# EAGLE design CCM_0021 (EAGLE 9.3.1)
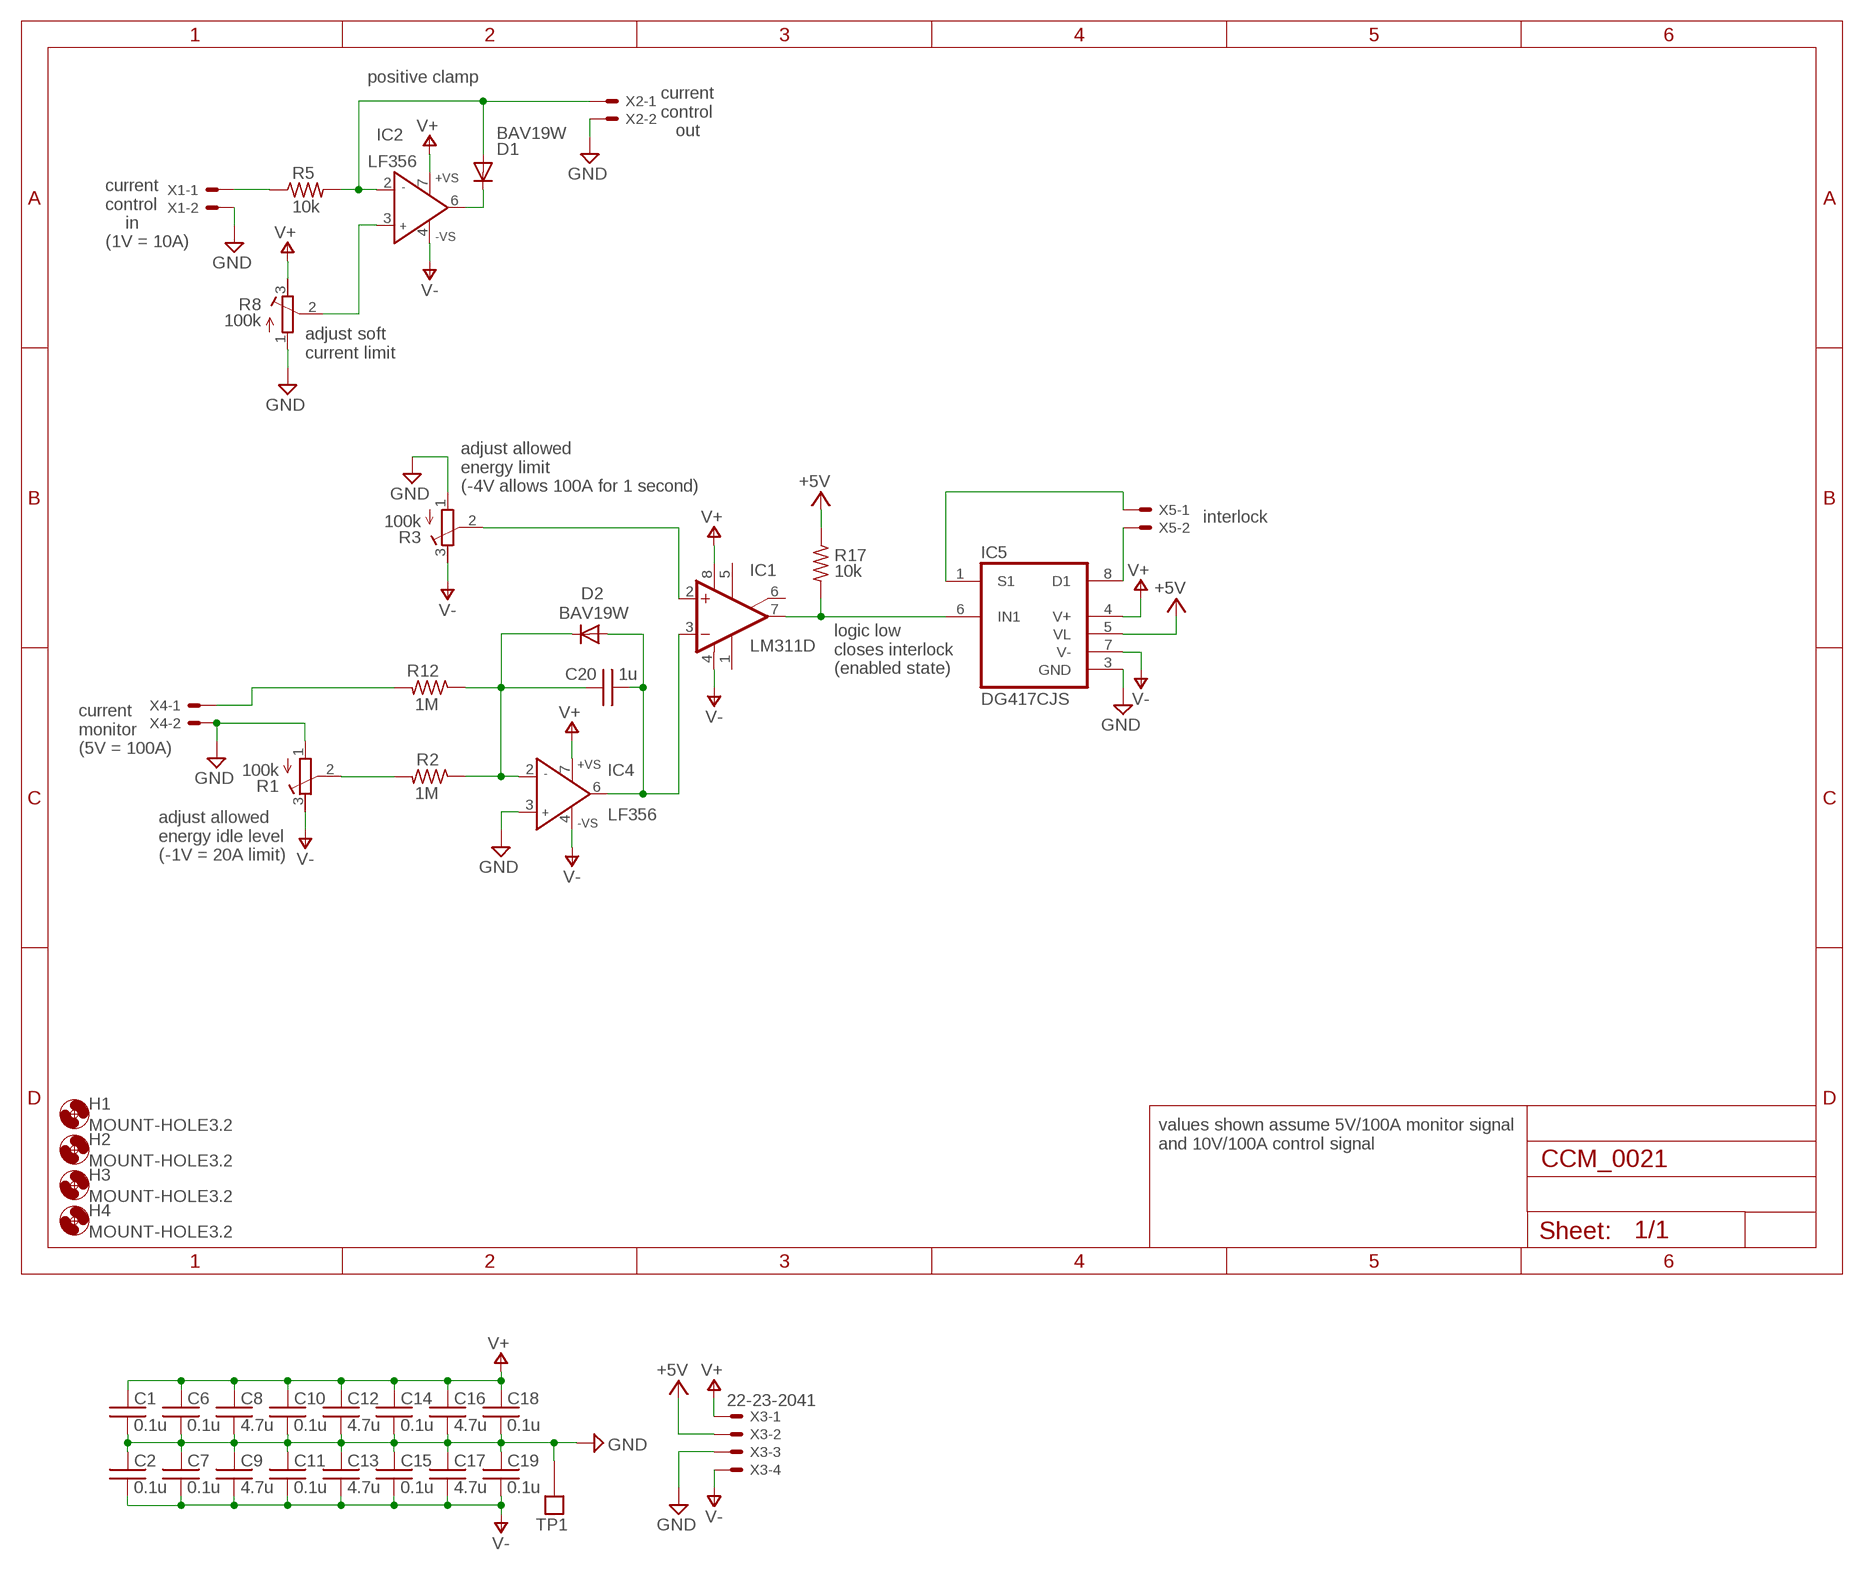
[diagram p0: schematic, sheet 1]

## Parts
C1  0.1u  C0603  [0603]
C2  0.1u  C0603  [0603]
C6  0.1u  C0603  [0603]
C7  0.1u  C0603  [0603]
C8  4.7u  C0603  [0603]
C9  4.7u  C0603  [0603]
C10  0.1u  C0603  [0603]
C11  0.1u  C0603  [0603]
C12  4.7u  C0603  [0603]
C13  4.7u  C0603  [0603]
C14  0.1u  C0603  [0603]
C15  0.1u  C0603  [0603]
C16  4.7u  C0603  [0603]
C17  4.7u  C0603  [0603]
C18  0.1u  C0603  [0603]
C19  0.1u  C0603  [0603]
C20  1u  C0603  [0603]
D1  BAV19W  DIODE-SOD123  [SOD123]
D2  BAV19W  DIODE-SOD123  [SOD123]
H1  MOUNT-HOLE3.2  [3,2]
H2  MOUNT-HOLE3.2  [3,2]
H3  MOUNT-HOLE3.2  [3,2]
H4  MOUNT-HOLE3.2  [3,2]
IC1  LM311D  [SO08]
IC2  LF356  AD825_BR  [SO8]
IC4  LF356  AD825_BR  [SO8]
IC5  DG417CJS  [SO8]
R1  100k  R-TRIMM3296W  [RTRIM3296W]
R2  1M  R0603  [0603]
R3  100k  R-TRIMM3296W  [RTRIM3296W]
R5  10k  R0603  [0603]
R8  100k  R-TRIMM3296W  [RTRIM3296W]
R12  1M  R0603  [0603]
R17  10k  R0603  [0603]
TP1  TESTPOINT  [TESTPOINT]
X1  22-23-2021  [22-23-2021]
X2  22-23-2021  [22-23-2021]
X3  22-23-2041  [22-23-2041]
X4  22-23-2021  [22-23-2021]
X5  22-23-2021  [22-23-2021]

## Nets
+5V: IC5.5(VL) R17.1 X3.2
GND: C1.2 C2.1 C6.2 C7.1 C8.2 C9.1 C10.2 C11.1 C12.2 C13.1 C14.2 C15.1 C16.2 C17.1 C18.2 C19.1 IC4.3(IN+) IC5.3(GND) R1.1(A) R3.1(A) R8.1(A) TP1.P$1 X1.2 X2.2 X3.3 X4.2
N$1: R12.2 X4.1
N$2: R1.2(S) R2.2
N$3: C20.1 D2.A IC1.3(-IN) IC4.6(OUT)
N$4: IC1.2(+IN) R3.2(S)
N$5: IC1.7(OUT) IC5.6(IN1) R17.2
N$7: IC5.1(S1) X5.1
N$8: IC5.8(D1) X5.2
N$9: D1.C IC2.6(OUT)
N$10: IC2.3(IN+) R8.2(S)
N$13: R5.1 X1.1
N$16: D1.A IC2.2(IN-) R5.2 X2.1
N$33: C20.2 D2.C IC4.2(IN-) R2.1 R12.1
V+: C1.1 C6.1 C8.1 C10.1 C12.1 C14.1 C16.1 C18.1 IC1.8(V+) IC2.7(+VS) IC4.7(+VS) IC5.4(V+) R8.3(E) X3.1
V-: C2.2 C7.2 C9.2 C11.2 C13.2 C15.2 C17.2 C19.2 IC1.4(V-) IC2.4(-VS) IC4.4(-VS) IC5.7(V-) R1.3(E) R3.3(E) X3.4
Unconnected: IC1.1(GND) IC1.5(ON) IC1.6(ON/STR)

## Notes on the sheet
- positive clamp
- current
  control
     out
- current
  control
      in
  (1V = 10A)
- adjust soft 
  current limit
- adjust allowed 
  energy limit
  (-4V allows 100A for 1 second)
- interlock
- logic low
  closes interlock
  (enabled state)
- current
  monitor
  (5V = 100A)
- adjust allowed 
  energy idle level
  (-1V = 20A limit)
- values shown assume 5V/100A monitor signal
  and 10V/100A control signal

## Library data of the parts
C1 C2 C6-C20 = acrooptics:C: Capacitor
D1 D2 = AquariumLibrary:DIODE-: DIODE
H1-H4 = holes:MOUNT-HOLE: MOUNTING HOLE with drill center marker
IC1 = linear:LM311: COMPARATOR
IC2 IC4 = noah:AD825_B: Low Cost, General-Purpose High Speed JFET Amplifier Source: http://www.analog.com/static/imported-files/data_sheets/AD825.pdf; MF: ALTERA CORPORATION; MPN: AD825ARZ; OC_FARNELL: 9603735; OC_NEWARK: 59K6528
IC5 = noah:DG417CJ: ANALOG SWITCH
R1 R3 R8 = rcl:R-TRIMM: Trimm resistor; SPICEMODEL: X; SPICEPREFIXL: POT
R2 R5 R12 R17 = acrooptics:R: 0603 resistor
TP1 = Fitch:TESTPOINT
X1 X4 = con-molex:22-23-2021: .100" (2.54mm) Center Header - 2 Pin; MF: MOLEX; MPN: 22-23-2021; OC_FARNELL: 1462926; OC_NEWARK: 25C3832; SPICEPREFIX: X
X2 X5 = con-molex:22-23-2021: .100" (2.54mm) Center Header - 2 Pin; MF: MOLEX; MPN: 22-23-2021; OC_FARNELL: 1462926; OC_NEWARK: 25C3832
X3 = con-molex:22-23-2041: .100" (2.54mm) Center Header - 4 Pin; MF: MOLEX; MPN: 22-23-2041; OC_FARNELL: 1462920; OC_NEWARK: 38C0355

## Net classes
1 standard: width 0.61 mm, clearance 0.254 mm

## Board
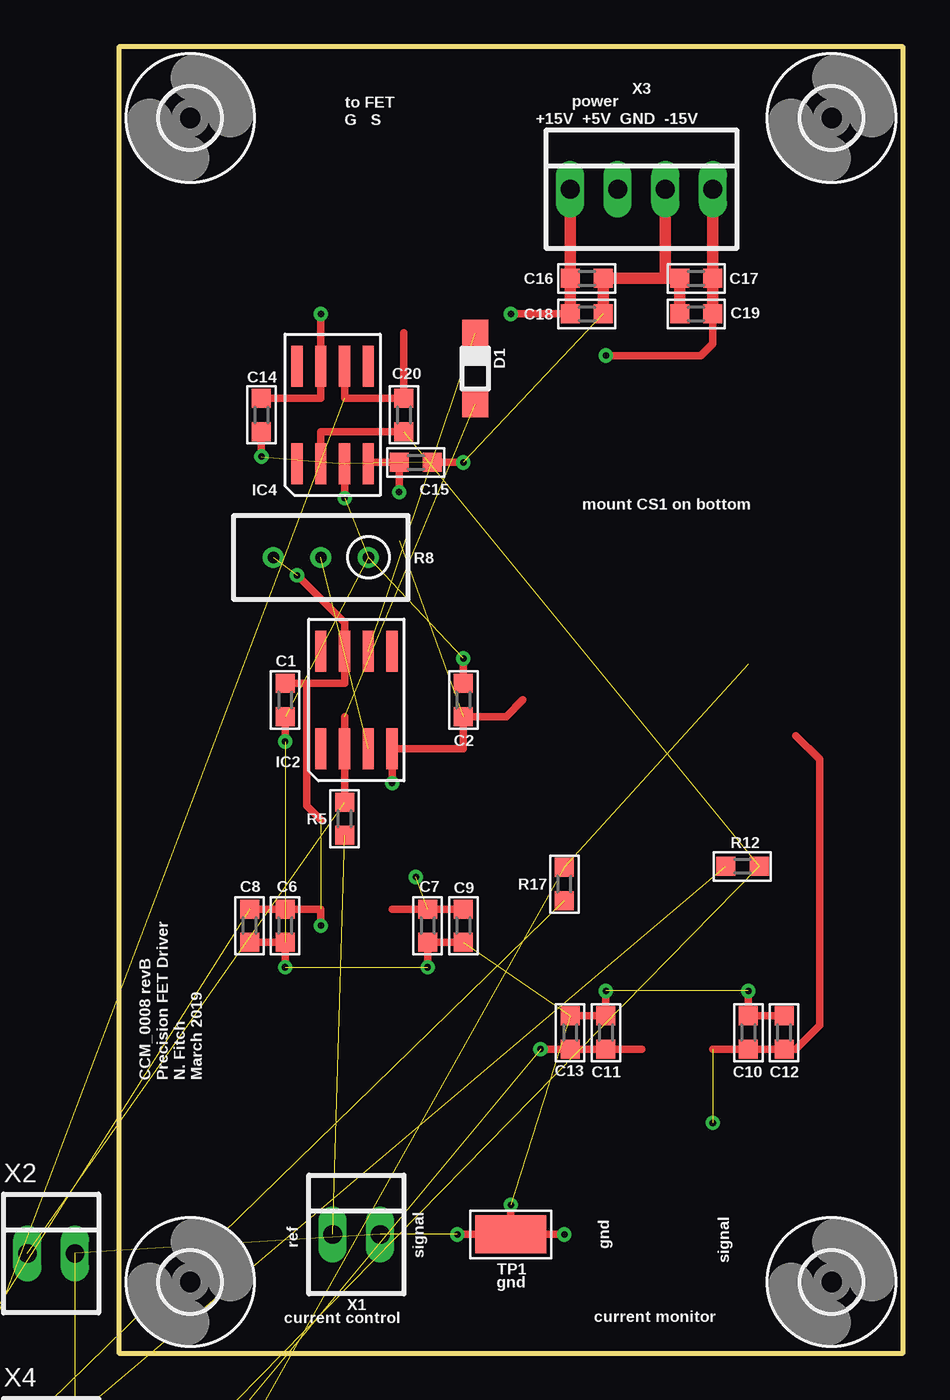
[diagram p1: board, top side]
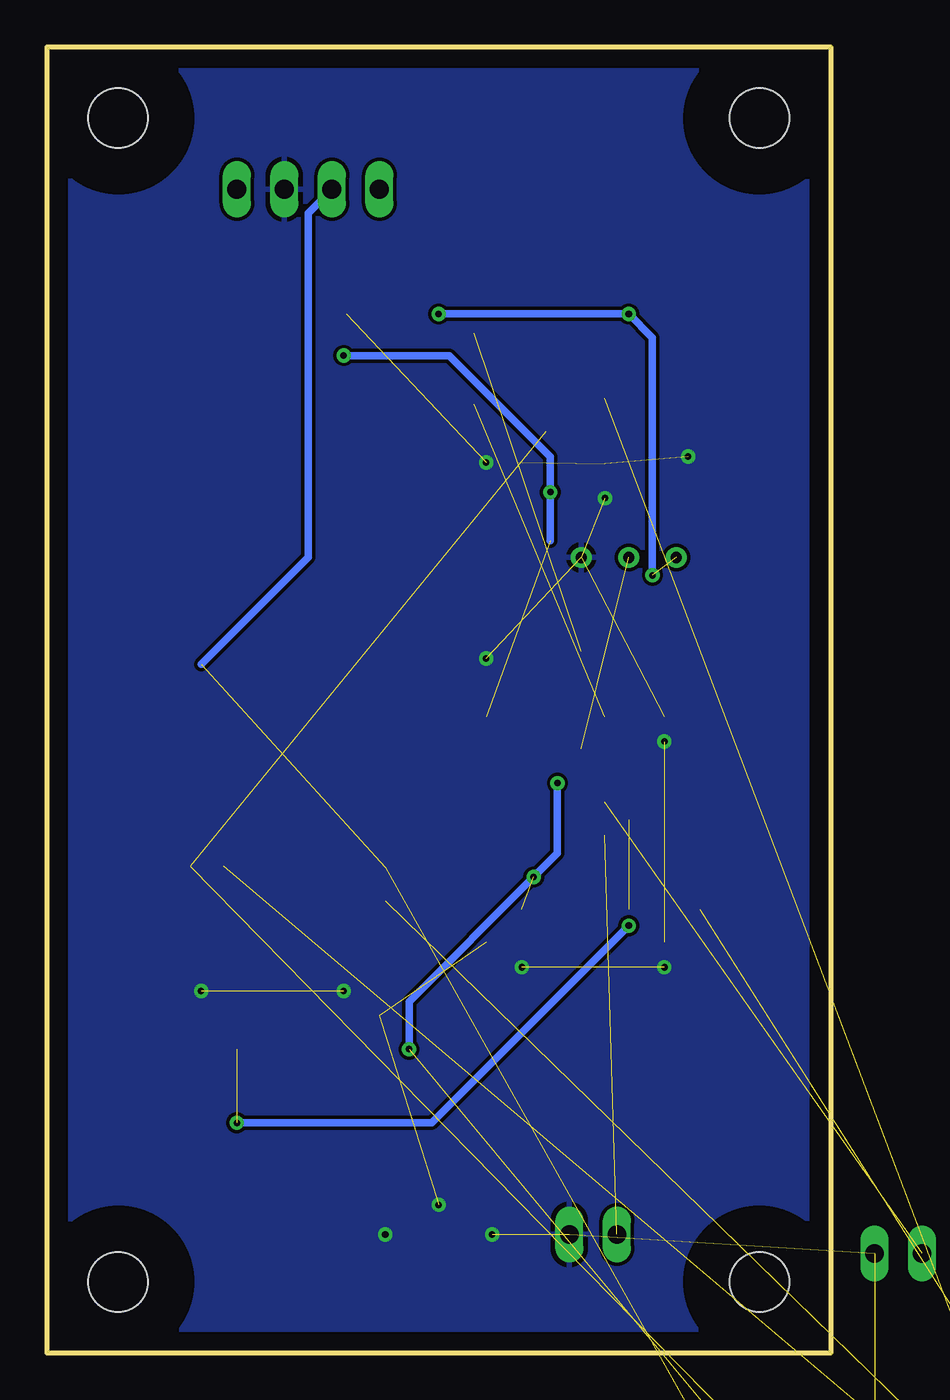
[diagram p2: board, bottom side, seen from below]

Size 41.91 x 69.85 mm. Coordinates in mm from the lower left corner, seen from the top.
Outline: 0,0 41.91,0 41.91,69.85 0,69.85 0,0
Copper layers (1*16): Top 0.035mm / dielectric 1.5mm / Bottom 0.035mm
Design rules "default *": minimum track width 10mil, minimum drill 10mil, track to track 7mil, track to pad 7mil, pad to pad 7mil, via to via 7mil, smd to smd 7mil, copper to edge 10mil, drill to drill 8mil, minimum pad ring 10mil, minimum via ring 8mil, stop-mask expansion 4mil, vias tented up to drill 0mil, thermal gap 10mil

### Footprints (pad centres in the part's own frame; a part is rotated, then mirrored left to right if it is on the bottom)
0603 = smd 1.016 x 1.016: 1 -0.889,0; 2 0.889,0
SOD123 = smd 1.4 x 1.4: A 1.9,0; C -1.9,0
3,2 = hole 3.2: 0,0
SO08 = smd 0.6 x 2.2: 1 -1.905,-2.6; 2 -0.635,-2.6; 3 0.635,-2.6; 4 1.905,-2.6; 5 1.905,2.6; 6 0.635,2.6; 7 -0.635,2.6; 8 -1.905,2.6
SO8 = smd 0.6 x 2.2: 1 -1.905,-2.6; 2 -0.635,-2.6; 3 0.635,-2.6; 4 1.905,-2.6; 5 1.905,2.6; 6 0.635,2.6; 7 -0.635,2.6; 8 -1.905,2.6
RTRIM3296W = drill 0.61: 1 0,-2.54; 2 0,0; 3 0,2.54
TESTPOINT = smd 3.81 x 2.032: P$1 0,0
22-23-2021 = drill 1 long: 1 -1.27,0; 2 1.27,0
22-23-2041 = drill 1 long: 1 -3.81,0; 2 -1.27,0; 3 1.27,0; 4 3.81,0

### Placement (x,y rotation side)
C1  8.89,34.92 270 top
C2  18.41,34.92 270 top
C6  8.89,22.86 270 top
C7  16.51,22.86 90 top
C8  6.99,22.86 270 top
C9  18.41,22.86 90 top
C10  33.66,17.14 90 top
C11  26.04,17.14 270 top
C12  35.56,17.14 90 top
C13  24.13,17.14 270 top
C14  7.62,50.16 270 top
C15  15.88,47.62 180 top
C16  25.02,57.47 0 top
C17  30.86,57.47 0 top
C18  25.02,55.56 0 top
C19  30.86,55.56 0 top
C20  15.24,50.16 270 top
D1  19.05,52.64 270 top
D2  -26.1,-33.72 0 top  (outside the outline)
H1  3.81,3.81 0 top
H2  3.81,66.04 0 top
H3  38.1,3.81 0 top
H4  38.1,66.04 0 top
IC1  -15.37,-17.14 0 top  (outside the outline)
IC2  12.7,34.92 0 top
IC4  11.43,50.16 0 top
IC5  -31.05,-70.99 0 top  (outside the outline)
R1  -2.16,-16 0 top  (outside the outline)
R2  -8.64,-18.67 0 top  (outside the outline)
R3  -24.32,-25.84 0 top  (outside the outline)
R5  12.06,28.57 90 top
R8  10.79,42.55 90 top
R12  33.34,26.04 180 top
R17  23.81,25.08 270 top
TP1  20.95,6.35 0 top
X1  12.7,6.35 0 top
X2  -3.62,5.33 0 top
X3  27.94,62.23 0 top
X4  -3.62,-5.59 0 top  (outside the outline)
X5  -25.72,-41.85 0 top  (outside the outline)

### Tracks (layer width: path | path; a pad name or v marks a point on that pad's centre or on a via)
+5V  (2 unrouted)
  Bottom 0.406: X3.2 27.94,60.96 27.94,42.55 33.66,36.83
GND  (via drill 0.35)  (17 unrouted)
  Top 0.406: v16.51,20.64 C7.1 C9.1 | v8.89,20.64 C6.2 C8.2 | C1.2 v8.89,32.7 | C2.1 v18.41,37.15 | v26.04,19.37 C11.1 C13.1 | v33.66,19.37 C10.2 C12.2 | TP1.P$1 v18.1,6.35 | TP1.P$1 v20.95,7.94 | TP1.P$1 v23.81,6.35 | IC4.3 v12.06,45.72 | C14.2 v7.62,47.94 | C15.1 v18.41,47.62
  Top 0.61: C18.2 C16.2 29.15,57.47 | C19.1 C17.1 29.15,57.47 | X3.3 29.21,57.53 29.15,57.47
  pour Bottom: 1.27,1.27 1.27,68.58 40.64,68.58 40.64,1.27
N$1  (1 unrouted)
N$2  (1 unrouted)
N$3  (2 unrouted)
  Top 0.406: IC4.6 12.06,51.05 C20.1 15.24,54.55
N$4  (1 unrouted)
N$5  (2 unrouted)
N$7  (1 unrouted)
N$8  (1 unrouted)
N$9  (1 unrouted)
N$10  (1 unrouted)
N$13  (1 unrouted)
N$16  (2 unrouted)
  Top 0.406: 12.06,34.04 IC2.2 R5.2
N$33  (3 unrouted)
  Top 0.406: C20.2 10.79,49.28 IC4.2
V+  (via drill 0.35)  (5 unrouted)
  Top 0.406: 10.03,35.81 12.06,35.81 IC2.7 12.06,39.05 v9.53,41.59 | 10.03,35.81 C1.1 | 36.2,33.02 37.47,31.75 37.47,17.53 36.2,16.26 C12.1 C10.1 31.75,16.26 | C8.1 C6.1 10.79,23.75 v10.79,22.86 | C14.1 10.79,51.05 IC4.7 v10.79,55.56 | C18.1 v20.95,55.56 | 10.79,28.51 10.03,29.27 10.03,35.81
  Top 0.61: X3.1 C16.1 C18.1
  Bottom 0.406: v20.95,55.56 v10.79,55.56 9.53,54.29 v9.53,41.59 | v10.79,22.86 21.34,12.32 v31.75,12.32
V-  (via drill 0.35)  (6 unrouted)
  Top 0.406: 14.61,23.75 C7.2 C9.2 | 13.34,47.69 13.34,47.62 | 13.34,47.62 IC4.4 | 27.94,16.26 C11.2 C13.2 v22.54,16.26 | 21.59,34.92 20.7,34.04 C2.2 18.41,32.33 IC2.4 v14.61,30.48 | 13.34,47.62 C15.2 v14.99,46.04 | 15.86,25.48 v15.88,25.46 | C19.2 31.75,53.98 31.11,53.34 v26.04,53.34
  Top 0.61: C19.2 C17.2 X3.4
  Bottom 0.406: 14.99,43.43 v14.99,46.04 14.99,47.94 20.38,53.34 v26.04,53.34 | v22.54,16.26 22.54,18.8 v15.88,25.46 14.61,26.73 v14.61,30.48

### Text on the board
tPlace: CCM_0008 revB / Precision FET Driver / N. Fitch / March 2019 | gnd
tNames: to FET / G S | power / +15V +5V GND -15V | mount CS1 on bottom | ref | gnd | signal | signal | current control | current monitor